# EAGLE design Clamp-header (EAGLE 7.6.0)
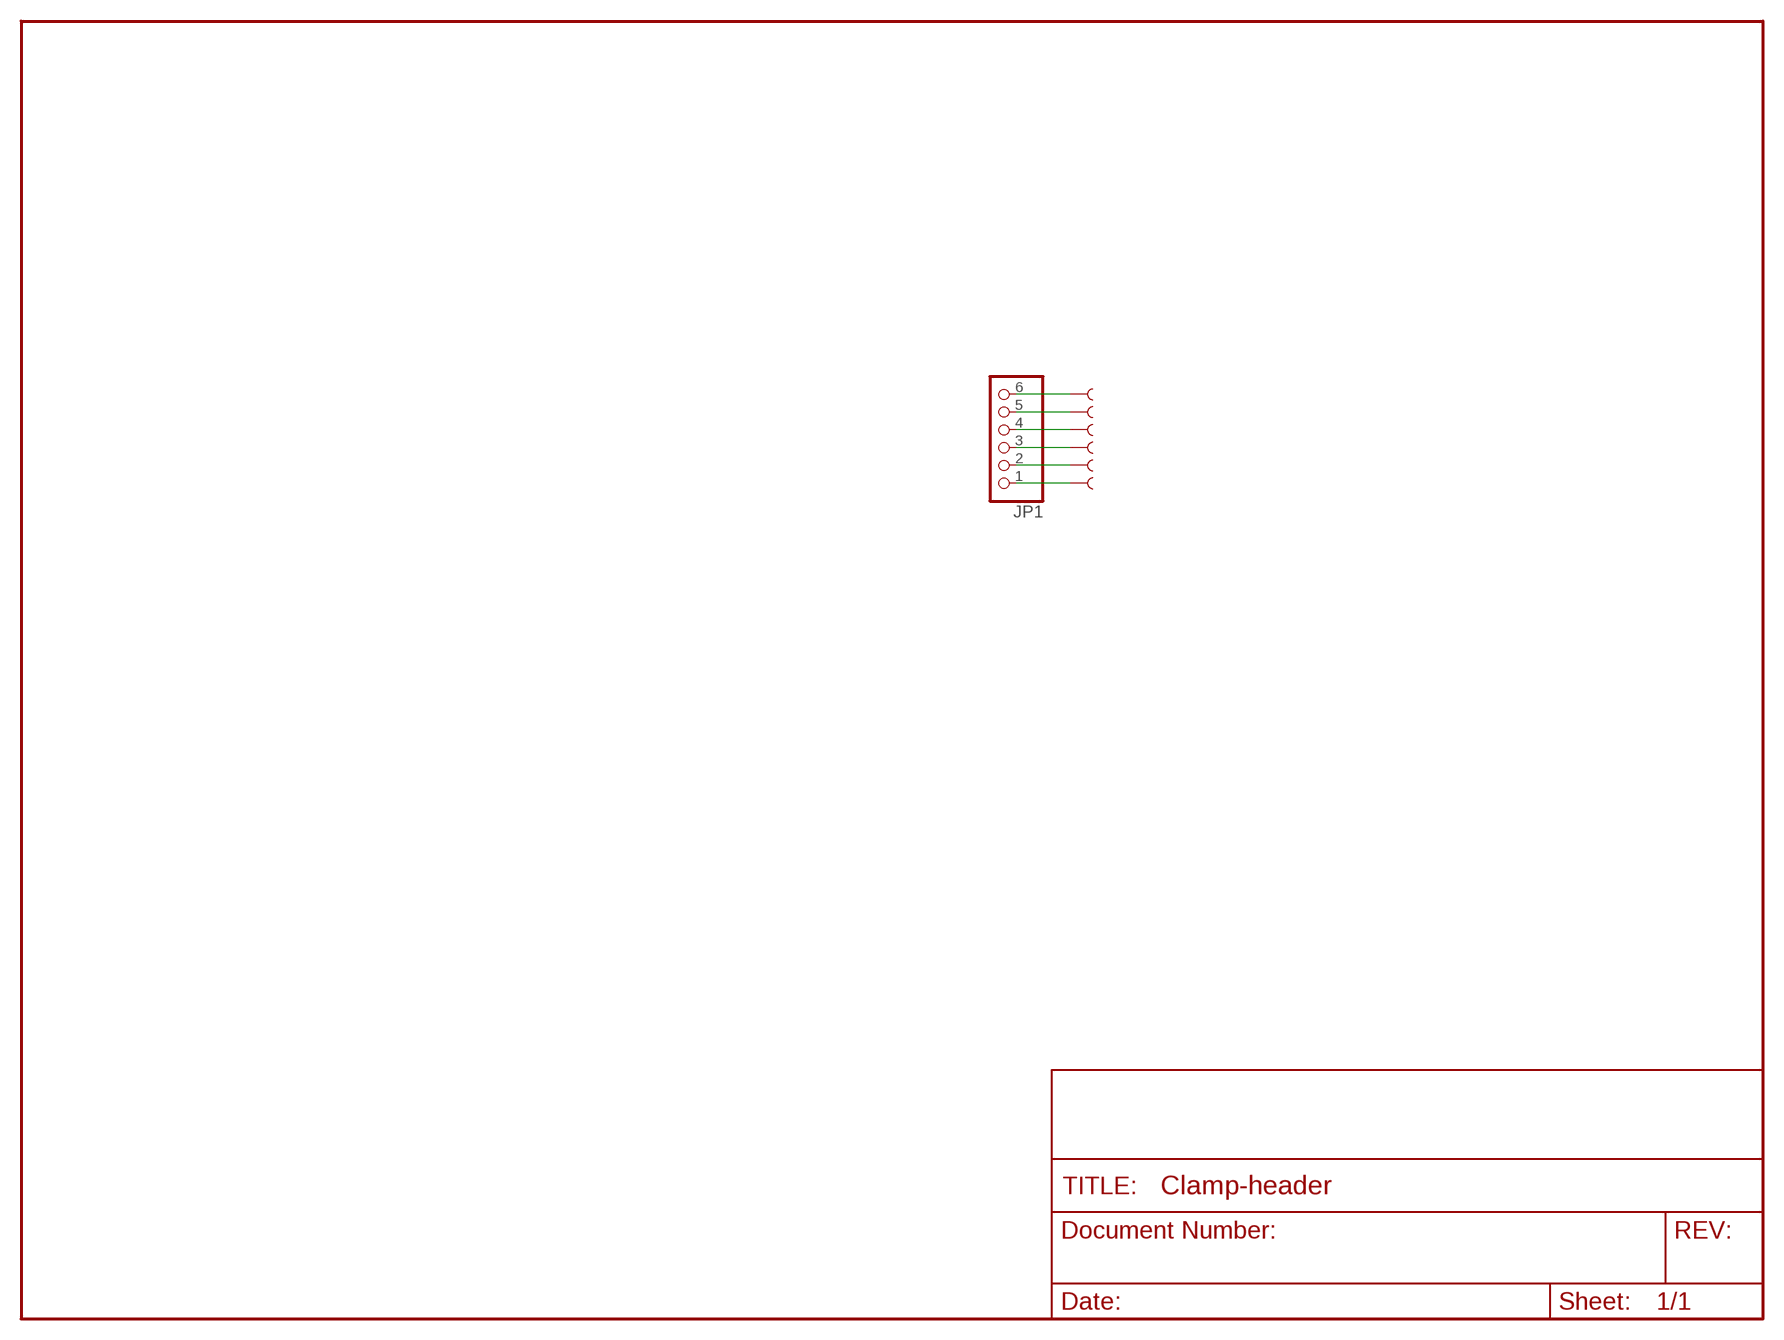
[diagram p0: schematic, sheet 1]

## Parts
JP1  PINHD-1X6/90  [1X06/90]
U$1  SEWTAP1  [SEWTAP]
U$2  SEWTAP1  [SEWTAP]
U$3  SEWTAP1  [SEWTAP]
U$5  SEWTAP1  [SEWTAP]
U$6  SEWTAP1  [SEWTAP]
U$7  SEWTAP1  [SEWTAP]

## Nets
N$7: JP1.6 U$3.1
N$8: JP1.5 U$6.1
N$9: JP1.4 U$7.1
N$10: JP1.3 U$1.1
N$11: JP1.2 U$5.1
N$12: JP1.1 U$2.1

## Library data of the parts
JP1 = pinhead:PINHD-1X6: PIN HEADER
U$1-U$3 U$5-U$7 = LilyPad-Wearables:SEWTAP

## Net classes
0 Default: width 0.203 mm
1 VCC: width 0.305 mm

## Board
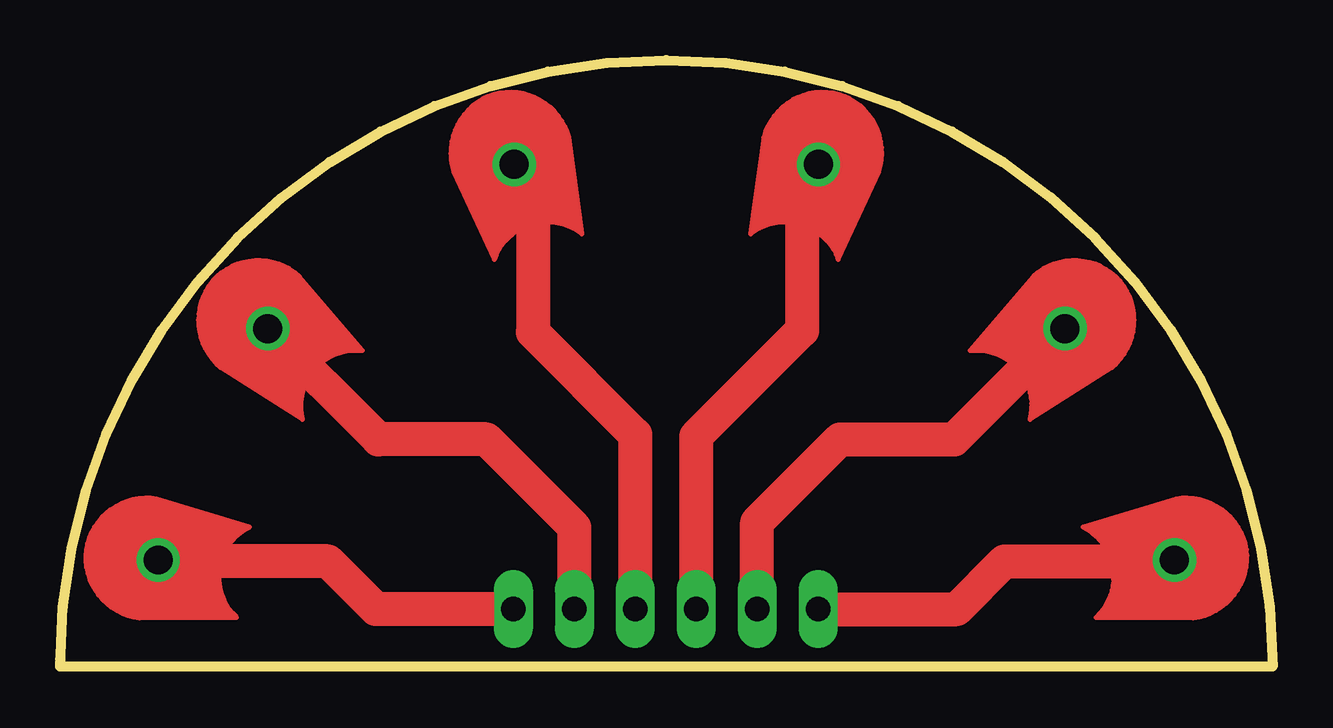
[diagram p1: board, top side]
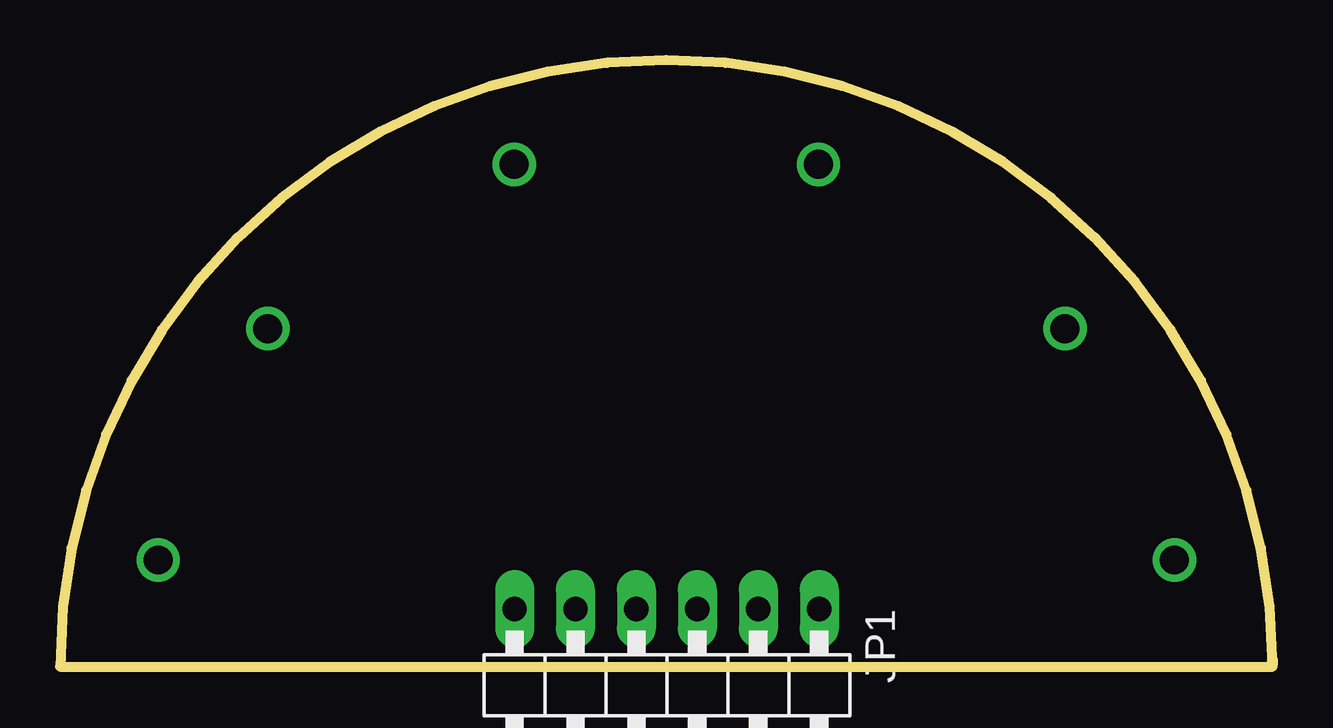
[diagram p2: board, bottom side, seen from below]

Size 50.55 x 25.27 mm. Coordinates in mm from the lower left corner, seen from the top.
Outline: 0,0.32 0,0.06
Outline: 50.55,0 0,0 arc-180 50.55,0
Copper layers (1*16): Top 0.035mm / dielectric 1.5mm / Bottom 0.035mm
Design rules "SparkFun": minimum track width 8mil, minimum drill 20mil, track to track 8mil, track to pad 8mil, pad to pad 8mil, via to via 8mil, smd to smd 8mil, copper to edge 10mil, drill to drill 8mil, minimum pad ring 12mil, minimum via ring 10mil, stop-mask expansion 4mil, vias tented up to drill 20mil, thermal gap 10mil

### Footprints (pad centres in the part's own frame; a part is rotated, then mirrored left to right if it is on the bottom)
1X06/90 = drill 1.016 long: 1 -6.35,-3.81; 2 -3.81,-3.81; 3 -1.27,-3.81; 4 1.27,-3.81; 5 3.81,-3.81; 6 6.35,-3.81
SEWTAP = drill 1.2: 1 0.03,0

### Placement (x,y rotation side)
JP1  25.25,-1.42 180 bottom
U$1  18.92,20.96 286.3 top
U$2  4.06,4.45 351.8 top
U$3  46.48,4.45 188.2 top
U$5  8.64,14.1 319.1 top
U$6  41.91,14.1 220.9 top
U$7  31.62,20.96 253.7 top

### Tracks (layer width: path | path; a pad name or v marks a point on that pad's centre or on a via)
N$7
  Top 1.422: JP1.6 37.38,2.39 39.37,4.38 46.39,4.38 U$3.1
N$8
  Top 1.422: JP1.5 29.06,6.01 32.51,9.46 37.27,9.46 U$6.1
N$9
  Top 1.422: U$7.1 30.94,20.25 30.94,14.01 26.52,9.59 JP1.4
N$10
  Top 1.422: U$1.1 19.71,20.15 19.71,13.93 23.98,9.66 JP1.3
N$11
  Top 1.422: JP1.2 21.44,5.8 17.78,9.46 13.27,9.46 U$5.1
N$12
  Top 1.422: JP1.1 13.17,2.39 11.18,4.38 4.15,4.38 U$2.1